# Altium project ESP32_Projet.PrjPcb
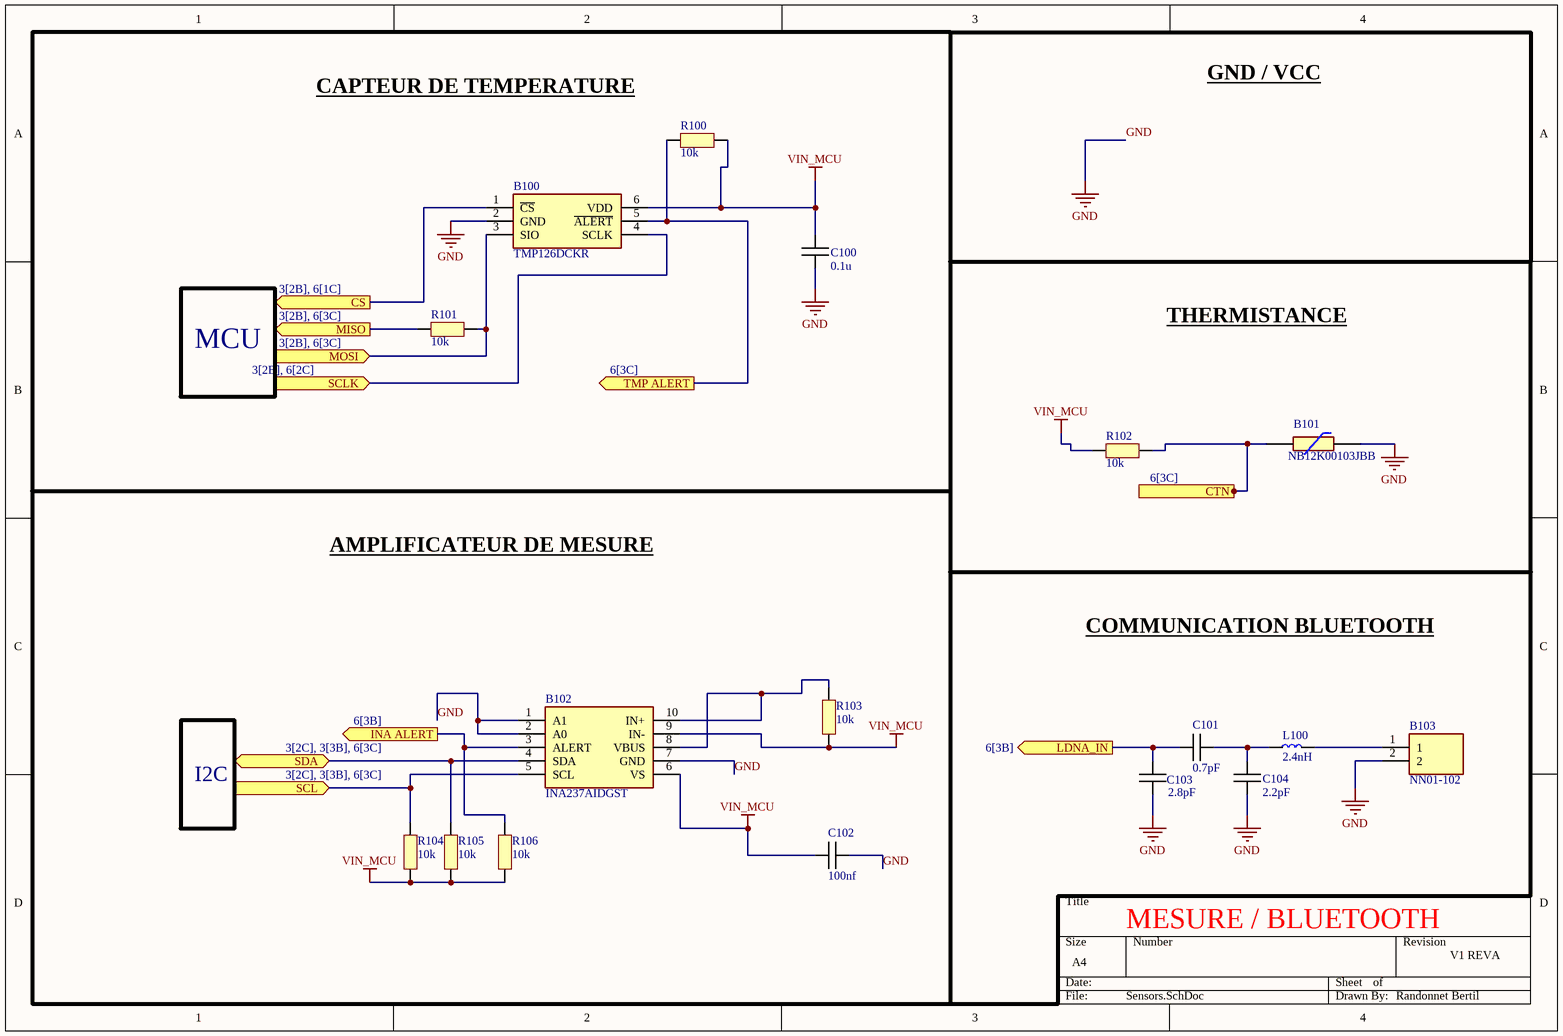
[diagram p0: Sensors.SchDoc]
6 sheets, 73 parts. Net scope: flat (ports and power ports of the same name join across sheets).
Board files: PCB1.PcbDoc, Copy of PCB1.PcbDoc
Sheets:
  Sensors.SchDoc
  protocoles de comm.SchDoc
  connecteurs.SchDoc
  IHM.SchDoc
  alim.SchDoc
  MCU_ESP32.SchDoc

## Sheet Sensors.SchDoc
size A4; SheetNumber: 1; SheetTotal: 6

### Parts
B100  TMP126DCKR  [SOT65P210X110-6N]
B101  NB12K00103JBB  [RESC2212X50N]
B102  INA237AIDGST  [SOP50P490X110-10N]
B103  NN01-102  [NN01-102]
C100  0.1u  [CAPC1005X06N]
C101  0.7pF  [CAPC1005X06N]
C102  100nf  [CAPC1005X06N]
C103  2.8pF  [CAPC1005X06N]
C104  2.2pF  [CAPC1005X06N]
L100  2.4nH  [LQPC1005X06N]
R100  10k  [RESC1005X06N]
R101  10k  [RESC1005X06N]
R102  10k  [RESC1005X06N]
R103  10k  [RESC1005X06N]
R104  10k  [RESC1005X06N]
R105  10k  [RESC1005X06N]
R106  10k  [RESC1005X06N]

### Ports
CS (out, see 3[2B], 6[1C]), CTN (out, see 6[3C]), INA ALERT (out, see 6[3B]), LDNA_IN (out, see 6[3B]), MISO (out, see 3[2B], 6[3C]), MOSI (in, see 3[2B], 6[3C]), SCL (in, see 3[2C], 3[3B], 6[3C]), SCLK (in, see 3[2B], 6[2C]), SDA (bidir, see 3[2C], 3[3B], 6[3C]), TMP ALERT (out, see 6[3C])

### Nets
GND: B100.2(GND) B101.1 B102.1(A1) B102.2(A0) B102.7(GND) B103.2 C100.2 C102.1 C103.2 C104.2
VIN_MCU: B100.6(VDD) B102.6(VS) B102.9(IN-) C100.1 C102.2 R100.2 R102.1 R103.1 R104.1 R105.1 R106.1
NetB100_1: B100.1(~{CS}) ; port CS
NetB100_3: B100.3(SIO) R101.2 ; port MOSI
NetB100_4: B100.4(SCLK) ; port SCLK
NetB100_5: B100.5(~{ALERT}) R100.1 ; port TMP ALERT
NetB101_2: B101.2 R102.2 ; port CTN
NetB102_3: B102.3(ALERT) R106.2 ; port INA ALERT
NetB102_4: B102.4(SDA) R105.2 ; port SDA
NetB102_5: B102.5(SCL) R104.2 ; port SCL
NetB102_8: B102.8(VBUS) B102.10(IN+) R103.2
NetB103_1: B103.1 L100.2
NetC101_1: C101.1 C103.1 ; port LDNA_IN
NetC101_2: C101.2 C104.1 L100.1
NetJ300_5: R101.1 ; port MISO

### Notes on the sheet
- CAPTEUR DE TEMPERATURE <https://www.ti.com/lit/ds/symlink/tmp126.pdf?ts=1732713559769&ref_url=https%253A%252F%252Fwww.ti.com%252Fproduct%252FTMP126>
- GND / VCC
- MCU
- THERMISTANCE <https://www.mouser.fr/datasheet/2/40/nc12_20-3165165.pdf>
- AMPLIFICATEUR DE MESURE <https://www.ti.com/lit/ds/symlink/ina237.pdf?ts=1732718382153&ref_url=https%253A%252F%252Fwww.ti.com%252Famplifier-circuit%252Fcurrent-sense%252Fdigital-power-monitors%252Fproducts.html>
- COMMUNICATION BLUETOOTH <https://www.mouser.fr/datasheet/2/40/nc12_20-3165165.pdf>
- I2C
- MESURE / BLUETOOTH
- V1 REVA
- Randonnet Bertil

### Library data of the parts
B100 = TMP126DCKR: Board Mount Temperature Sensors +/-0.25 C SPI temperature sensor with 175 C operation, CRC and slew-rate alert; Manufacturer_Name: Texas Instruments; Manufacturer_Part_Number: TMP126DCKR; Mouser Part Number: 595-TMP126DCKR
B101 = NB12K00103JBB: NTC SMD Thermistor, NB12K, 10K, 5% AVX 10k 0805 Protection NTC Thermistor, 5s, 2 x 1.25 x 1.3mm; Manufacturer_Name: Kyocera AVX; Geometry.Height: 0.5mm; Manufacturer_Part_Number: NB12K00103JBB; Mouser Part Number: 581-NB12K00103JBB; Mouser Price/Stock: https://www.mouser.co.uk/ProductDetail/AVX/NB12K00103JBB/?qs=4%252B6%252BTdINQeDPvI%252BQUQjJ3Q%3D%3D; Arrow Part Number: NB12K00103JBB; Arrow Price/Stock: https://www.arrow.com/en/products/nb12k00103jbb/avx; Datasheet Link: https://datasheet.datasheetarchive.com/originals/distributors/Datasheets-DGA6/551314.pdf
B102 = INA237AIDGST: Current Sense Amplifiers 85-V, 16-bit, I2C output current/voltage/power monitor with alert 10-VSSOP -40 to 125; Manufacturer_Name: Texas Instruments; Manufacturer_Part_Number: INA237AIDGST; Mouser Part Number: 595-INA237AIDGST
B103 = NN01-102: Antennes Compact Reach Xtend 2.4 GHz
C100-C104 = Capacitor
L100 = Bobine
R100-R106 = Resistor

## Sheet protocoles de comm.SchDoc: Protocole de communication
size A4; DrawnBy: TAHIRI Manelle; Revision: V1.0 REVA; SheetNumber: 2; SheetTotal: 5
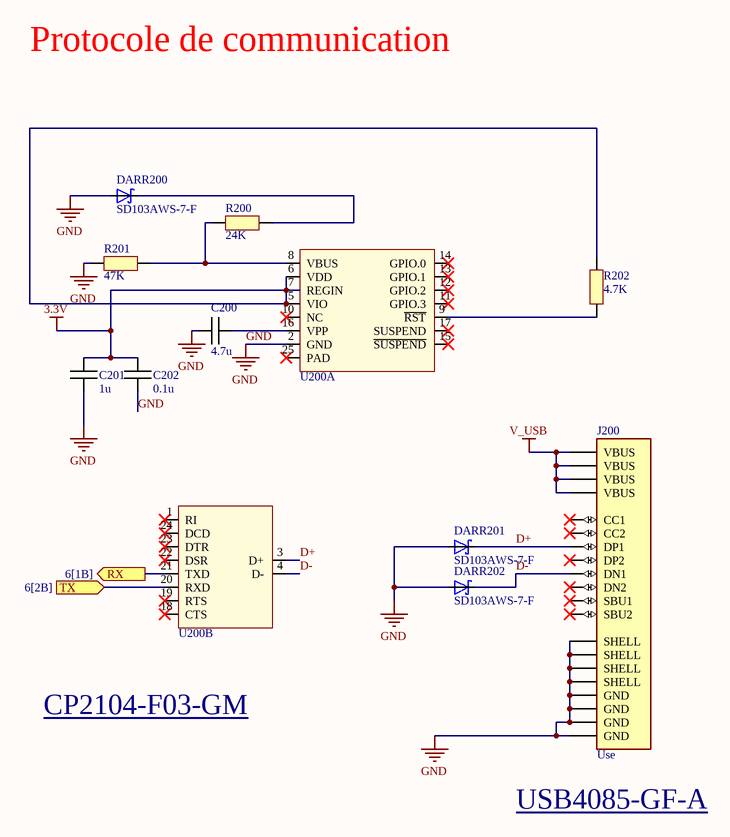
[diagram p1: protocoles de comm.SchDoc]

### Parts
C200  4.7u  [CAPC1005X06N]
C201  1u  [CAPC1005X06N]
C202  0.1u  [CAPC1005X06N]
DARR200  SD103AWS-7-F  [SD103AWS-7-F]
DARR201  SD103AWS-7-F  [SD103AWS-7-F]
DARR202  SD103AWS-7-F  [SD103AWS-7-F]
J200  Use  [USB4085-GF-A]
R200  24K  [RESC1005X06N]
R201  47K  [RESC1005X06N]
R202  4.7K  [RESC1005X06N]
U200  CP2104-F03-GM  [PQFN50P400X400X80_HS-25N]  (value not drawn)  (parts A,B of 2)

### Ports
RX (out, see 6[1B]), TX (in, see 6[2B])

### Nets
3.3V: C201.2 C202.2 R202.2 U200.5(VIO) U200.6(VDD) U200.7(REGIN)
GND: C200.1 C201.1 C202.1 DARR200.2(A) DARR201.2(A) DARR202.2(A) J200.A1(GND) J200.A12(GND) J200.B1(GND) J200.B12(GND) J200.S1(SHELL) J200.S2(SHELL) J200.S3(SHELL) J200.S4(SHELL) R201.1 U200.2(GND)
V_USB: J200.A4(VBUS) J200.A9(VBUS) J200.B4(VBUS) J200.B9(VBUS)
D+: DARR201.1(C) J200.A6(DP1) U200.3(D+)
D-: DARR202.1(C) J200.A7(DN1) U200.4(D-)
NetC200_2: C200.2 U200.16(VPP)
NetDARR200_1: DARR200.1(C) R200.2
NetR200_1: R200.1 R201.2 U200.8(VBUS)
NetR202_1: R202.1 U200.9(~{RST})
NetU100_40: U200.20(RXD) ; port TX
NetU100_41: U200.21(TXD) ; port RX

Not connected (* = marked no-connect by the designer): J200 A5(CC1)* A8(SBU1)* B5(CC2)* B6(DP2)* B7(DN2)* B8(SBU2)*; U200 1(RI)* 10(NC)* 11(GPIO.3)* 12(GPIO.2)* 13(GPIO.1)* 14(GPIO.0)* 15(~{SUSPEND})* 17(SUSPEND)* 18(CTS)* 19(RTS)* 22(DSR)* 23(DTR)* 24(DCD)* 25(PAD)*

### Notes on the sheet
- Protocole de communication
- CP2104-F03-GM <https://www.mouser.fr/datasheet/2/368/cp2104-1397921.pdf>
- (near J200) USB4085-GF-A <https://www.mouser.fr/datasheet/2/837/GCT_usb4085-3240028.pdf>

### Library data of the parts
C200-C202 = Capacitor
DARR200-DARR202 = SD103AWS-7-F: Diode Array 3 Independent Schottky 40V 175mA Surface Mount 6-TSSOP, SC-88, SOT-363
J200 = USB4085-GF-A: Connecteurs USB USB Type C, 2.0, Rec, TH , G/F, RA , Top Mnt, T & R
R200-R202 = Resistor
U200 = USBBridge: USB Bridge, USB to UART USB 2.0 UART Interface 24-QFN (4x4); Manufacturer 1: Silicon Labs; Supplier 1: Arrow Electronics; Supplier Part Number 1: CP2104-F03-GM; Manufacturer Part Number 1: CP2104-F03-GM

## Sheet connecteurs.SchDoc: Connecteurs
size A4; DrawnBy: TAHIRI Manelle; Revision: V1.0 REVA; SheetNumber: 3; SheetTotal: 6
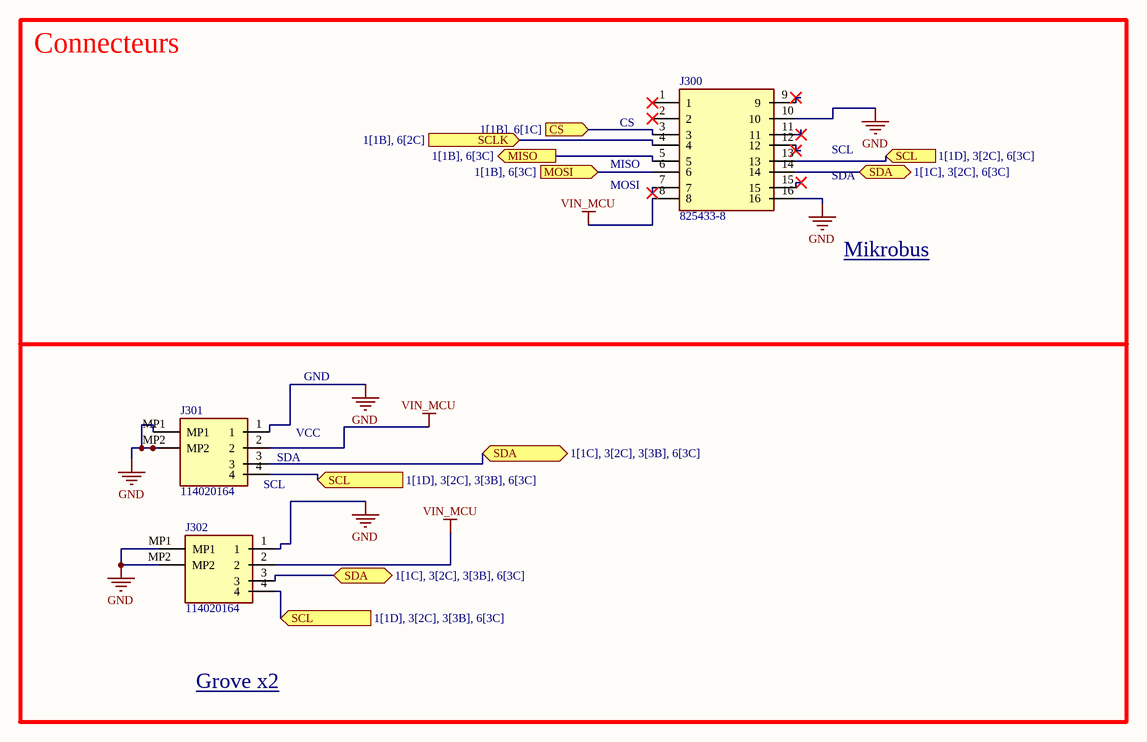
[diagram p2: connecteurs.SchDoc]

### Parts
J300  825433-8
J301  114020164  [114020164]
J302  114020164  [114020164]

### Blocks framed on the sheet
Connecteurs: J300-J302

### Ports
CS (in, see 1[1B], 6[1C]), MISO (out, see 1[1B], 6[3C]), MOSI (in, see 1[1B], 6[3C]), SCL (in, see 1[1D], 3[2C], 3[3B], 6[3C]), SCL (in, see 1[1D], 3[2C], 6[3C]), SCLK (in, see 1[1B], 6[2C]), SDA (bidir, see 1[1C], 3[2C], 3[3B], 6[3C]), SDA (bidir, see 1[1C], 3[2C], 6[3C])

### Nets
GND: J300.10 J300.16 J301.1 J301.MP1 J301.MP2 J302.1 J302.MP1 J302.MP2
VIN_MCU: J300.8 J301.2 J302.2
NetB100_1: J300.3 ; port CS
NetB100_3: J300.6 ; port MOSI
NetB100_4: J300.4 ; port SCLK
NetB102_4: J300.14 J301.3 J302.3 ; port SDA
NetB102_5: J300.13 J301.4 J302.4 ; port SCL
NetJ300_5: J300.5 ; port MISO

Not connected (* = marked no-connect by the designer): J300 1* 2* 7* 9* 11* 12* 15*

### Notes on the sheet
- (near J300) MISO
- (near J300) CS
- SCL
- (near J300) MOSI
- SDA
- Mikrobus <https://www.mouser.fr/datasheet/2/418/7/ENG_CD_825433_S_baseFilename-2068619.pdf>
- (near J301) VCC
- GND
- (near J301) SCL
- (near J301) SDA
- Grove x2 <https://www.mouser.fr/datasheet/2/744/Grove_Female_Header___SMD_4P_2_0mm_90D_Datasheet-3011316.pdf>

### Library data of the parts
J300 = Connect-Mikronus: Headers & Wire Housings 8P double for connection mikrobus; Manufacturer_Name: TE Connectivity; Manufacturer_Part_Number: 825433-8; Mouser Part Number: 571-825433-8
J301 J302 = 114020164: Seeed Studio Accessories Grove Female Header - SMD-4P-2.0mm-90D-20Pcs; Manufacturer_Name: Seeed Studio; Manufacturer_Part_Number: 114020164; Mouser Part Number: 713-114020164

## Sheet IHM.SchDoc: IHM
size A4; DrawnBy: Assil MAHFOUDI; Revision: V1.0 REV A; SheetNumber: 4; SheetTotal: 6
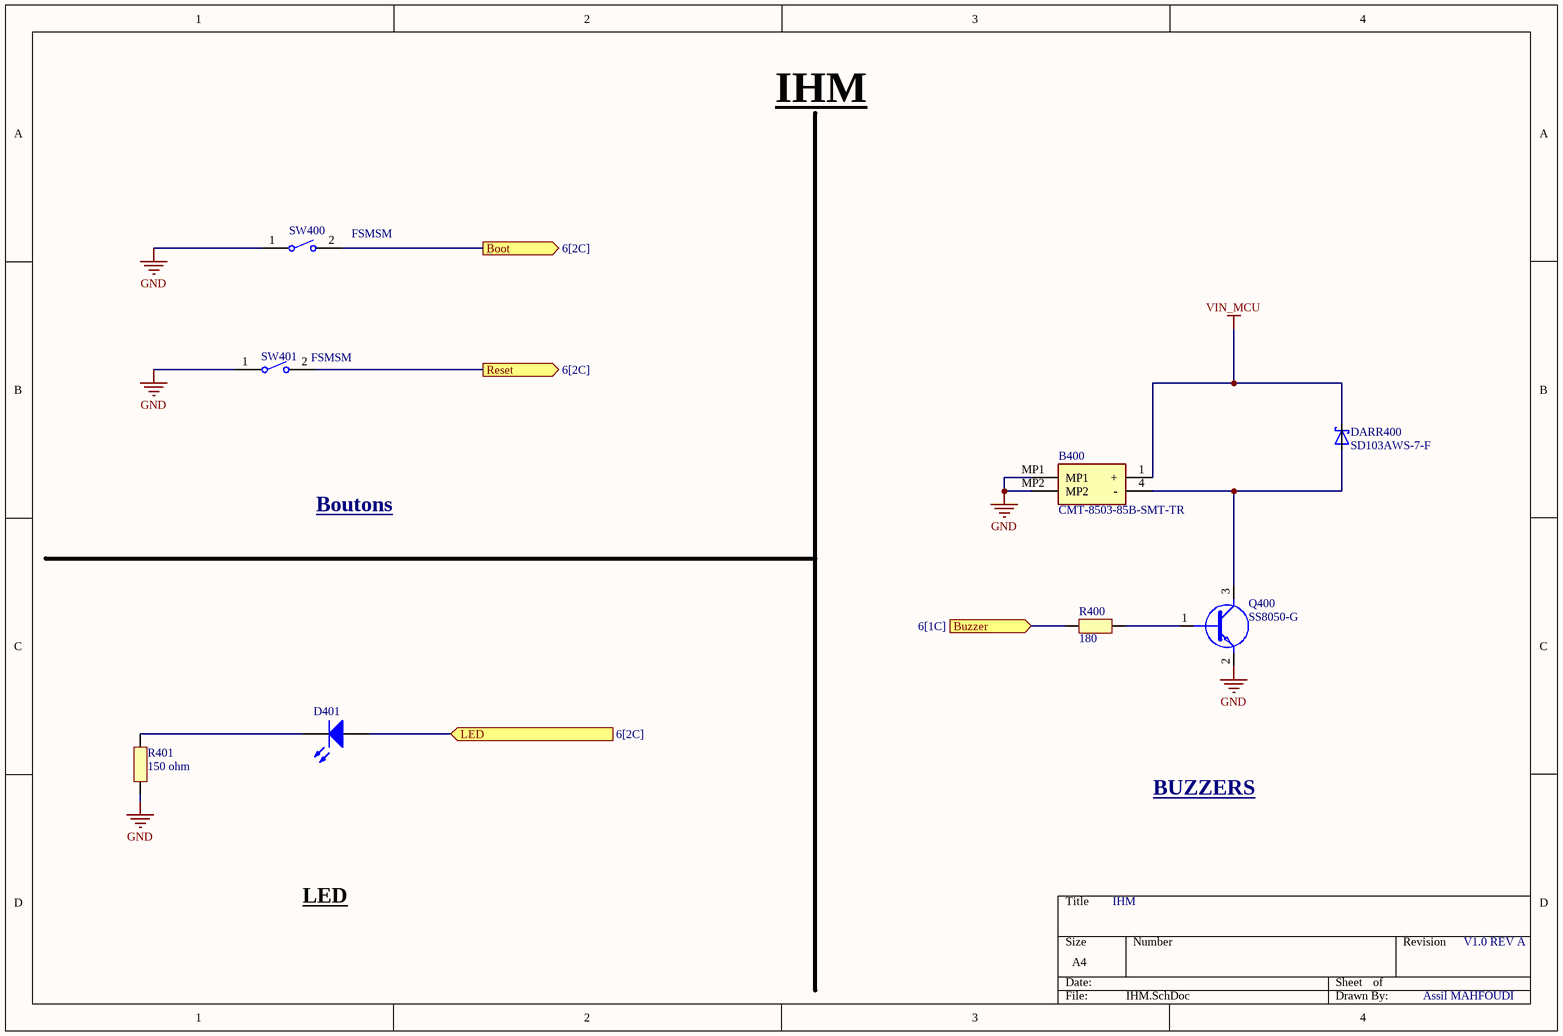
[diagram p3: IHM.SchDoc]

### Parts
B400  CMT-8503-85B-SMT-TR  [CMT850385BSMTTR]
D401  Light-Emitting Diode  (value not drawn)
DARR400  SD103AWS-7-F  [SD103AWS-7-F]
Q400  SS8050-G  [SS8050-G]
R400  180  [RESC1005X06N]
R401  150 ohm  [RESC1005X06N]
SW400  FSMSM  [TECO-FSMSM-2_V]
SW401  FSMSM  [TECO-FSMSM-2_V]

### Ports
Boot (out, see 6[2C]), Buzzer (in, see 6[1C]), LED (in, see 6[2C]), Reset (out, see 6[2C])

### Nets
GND: B400.MP1 B400.MP2 Q400.2(E) R401.1 SW400.1 SW401.1
VIN_MCU: B400.1(+) DARR400.1(C)
NetB400_4: B400.4(-) DARR400.2(A) Q400.3(C)
NetD401_1: D401.1(A) ; port LED
NetD401_2: D401.2(K) R401.2
NetQ400_1: Q400.1(B) R400.2
NetR400_1: R400.1 ; port Buzzer
NetSW400_2: SW400.2 ; port Boot
NetSW401_2: SW401.2 ; port Reset

### Notes on the sheet
- IHM
- Boutons <https://docs.rs-online.com/d386/0900766b80fa5b10.pdf>
- BUZZERS <https://eu.mouser.com/datasheet/2/1628/cmt_8503_85b_smt_tr-3509034.pdf>
- LED

### Library data of the parts
B400 = CMT-8503-85B-SMT-TR: Speakers & Transducers buzzer, 8.5 mm, 3 mm deep, M, 3.6 V, 85 dB, Surface Mount (SMT), Audio Transducer; Manufacturer_Name: Same Sky; Manufacturer_Part_Number: CMT-8503-85B-SMT-TR; Mouser Part Number: 490-CMT-850385BSMTTR
D401 = LED: AF: 1; BV: 0; BV_MAX: 1e99; EG: 1.11; FC: 0.5; IBV: 0.001; IS: 1e-14; MJSW: 0.33; NTUN: 30; TNOM: 27; XTI: 3; SimulationGenericComponent: True; CJO: 0; CJP: 0; CTA: 0; CTP: 0; FCS: 0.5; FV_MAX: 1e99; IKF: 0; IKR: 0; ISR: 1e-14; JSW: 0; JTUN: 0; JTUNSW: 0; KEG: 1; KF: 0; LEVEL: 1; N: 1; NBV: 1; NR: 1; NS: 1; PHP: 1; RS: 0; TCV: 0; TLEV: 0; TLEVC: 0; TM1: 0; TM2: 0; TPB: 0; TPHP: 0; TRS: 0; TRS2: 0; TT: 0; TTT1: 0; TTT2: 0; VJ: 1; XTITUN: 3
DARR400 = SD103AWS-7-F: as DARR200 on sheet protocoles de comm
Q400 = SS8050-G: Bipolar Transistors - BJT NPN TRANSISTOR 1.5A 40V
R400 R401 = Resistor
SW400 SW401 = CMP-2000-07511-1: FSMSM Push Button Switch, 50 mA, -35 to 85 degC, 2-Pin SMD, RoHS, Bulk; Manufacturer: TE Connectivity; Actuator Length: 1.07mm; Electrical Life: 20000Cycles; Actuator Material: Polyamide; Current Rating: 50mA; Illumination Type: Illuminated; Voltage Rating (DC): 24V; Contact Resistance: 100mOhm; Case\/Package: SMD/SMT; Operating Force: 180gf; Switch Travel: 0.25mm; Max Voltage Rating (DC): 12V; Throw Configuration: SPST; Packaging: LoosePiece; Max Operating Temperature: 85degC; ELV: Compliant; Package Description: 2-Pin Surface Mount Device, Body 6 x 3.5 mm, Pitch 9.19 mm; RoHSCompliant: true; Manufacturer URL: http://www.te.com/; Contact Plating: Silver; Contact Material: Brass; Mounting Technology: SurfaceMount; Contact Current Rating: 50mA; Datasheet Version: Rev. C2, 08/2014; Datasheet URL: http://www.te.com/commerce/DocumentDelivery/DDEController?Action=showdoc&DocId=Customer+Drawing%7F1437566-3%7FC2%7Fpdf%7FEnglish%7FENG_CD_1437566-3_C2_1437566_3_1_c.dwg.pdf%7F1437566-3; Mechanical Life: 20000Cycles; Package Reference: FSMSM; REACH SVHC: Unknown; Orientation: Straight; Min Operating Temperature: -35degC; Lead Free: LeadFree; Termination: GullWing; Package Quantity: 1000; Mount: SurfaceMount

## Sheet alim.SchDoc: Alimentation
size A4; ApprovedBy: Bertil RANDONNET; CheckedBy: Manelle TAHIRI; Author: Assil MAHFOUDI; DrawnBy: Assil MAHFOUDI; Engineer: Assil MAHFOUDI; Revision: V1.0 REV A; SheetNumber: 5; SheetTotal: 5
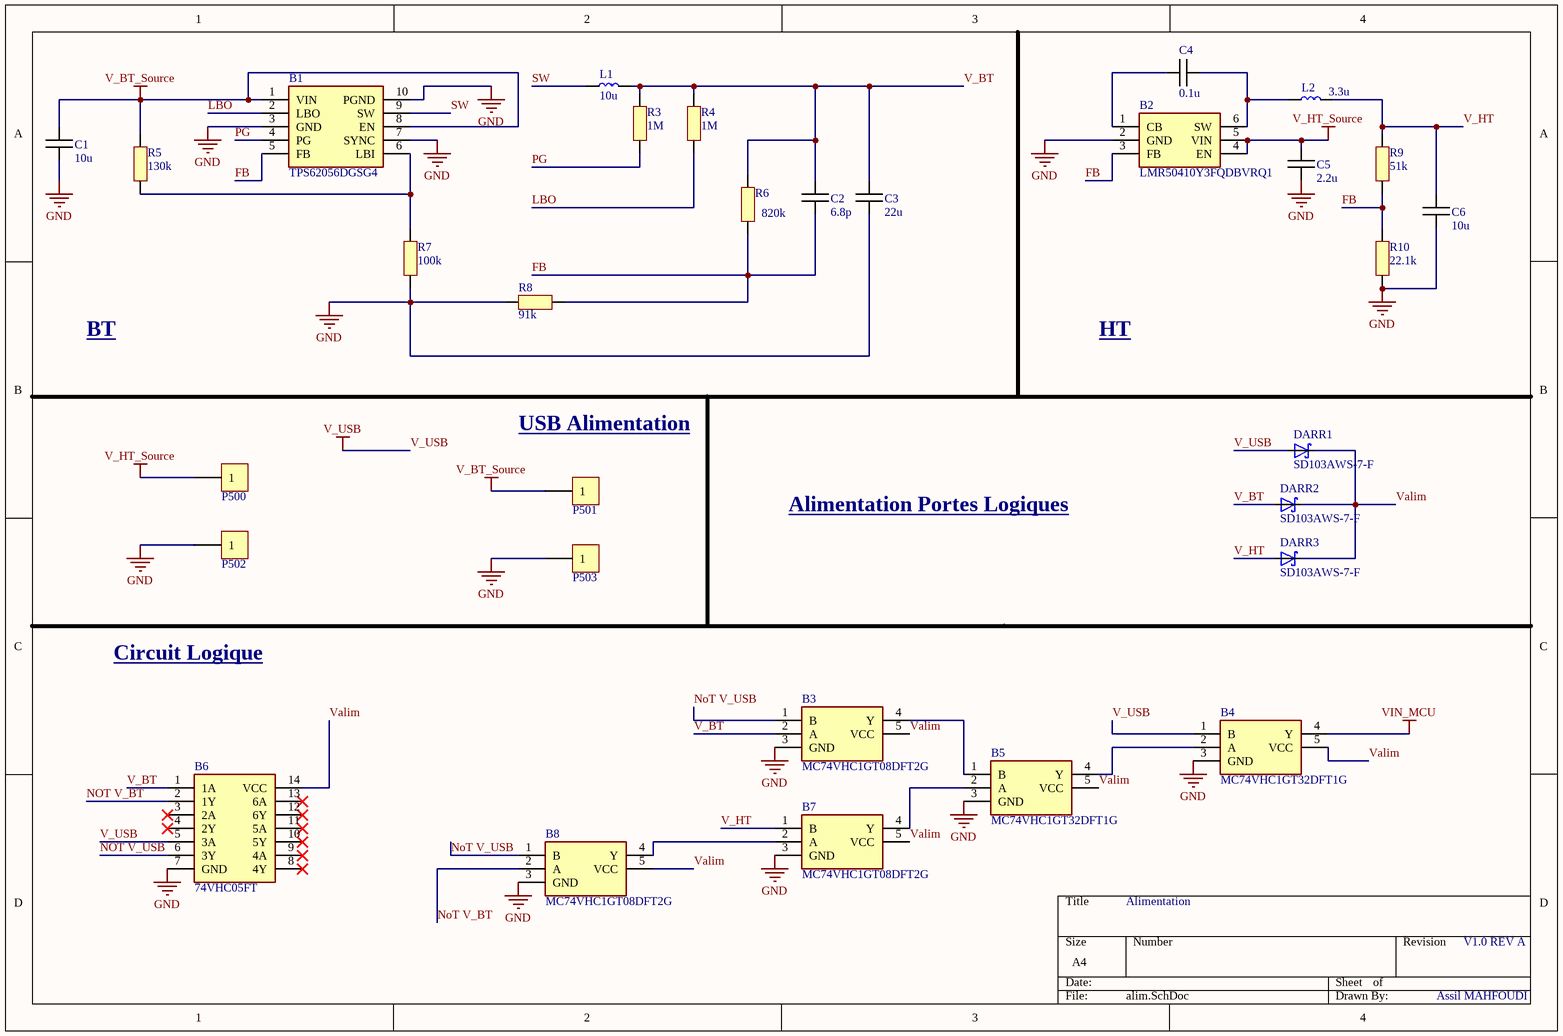
[diagram p4: alim.SchDoc]

### Parts
B1  TPS62056DGSG4  [SOP50P490X110-10N]
B2  LMR50410Y3FQDBVRQ1  [SOT95P280X145-6N]
B3  MC74VHC1GT08DFT2G  [SOT65P210X110-5N]
B4  MC74VHC1GT32DFT1G  [SOT65P210X110-5N]
B5  MC74VHC1GT32DFT1G  [SOT65P210X110-5N]
B6  74VHC05FT  [SOP65P640X120-14N]
B7  MC74VHC1GT08DFT2G  [SOT65P210X110-5N]
B8  MC74VHC1GT08DFT2G  [SOT65P210X110-5N]
C1  10u  [CAPC1005X06N]
C2  6.8p  [CAPC1005X06N]
C3  22u  [CAPC1005X06N]
C4  0.1u  [CAPC1005X06N]
C5  2.2u  [CAPC1005X06N]
C6  10u  [CAPC1005X06N]
DARR1  SD103AWS-7-F  [SD103AWS-7-F]
DARR2  SD103AWS-7-F  [SD103AWS-7-F]
DARR3  SD103AWS-7-F  [SD103AWS-7-F]
L1  10u  [LQPC1005X06N]
L2  3.3u  [LQPC1005X06N]
P500  Plage CMS 10x5  [Plage CMS 10x5]  (value not drawn)  (no BOM)
P501  Plage CMS 10x5  [Plage CMS 10x5]  (value not drawn)  (no BOM)
P502  Plage CMS 10x5  [Plage CMS 10x5]  (value not drawn)  (no BOM)
P503  Plage CMS 10x5  [Plage CMS 10x5]  (value not drawn)  (no BOM)
R3  1M  [RESC1005X06N]
R4  1M  [RESC1005X06N]
R5  130k  [RESC1005X06N]
R6  820k  [RESC1005X06N]
R7  100k  [RESC1005X06N]
R8  91k  [RESC1005X06N]
R9  51k  [RESC1005X06N]
R10  22.1k  [RESC1005X06N]

### Nets
GND: B1.3(GND) B1.7(SYNC) B1.10(PGND) B2.2(GND) B3.3(GND) B4.3(GND) B5.3(GND) B6.7(GND) B7.3(GND) B8.3(GND) C1.1 C3.2 C5.2 C6.1 P502.1 P503.1 R7.1 R8.1 R10.1
V_BT_Source: B1.1(VIN) B1.8(EN) C1.2 P501.1 R5.2
V_HT_Source: B2.4(EN) B2.5(VIN) C5.1 P500.1
V_USB: B4.1(B) B6.5(3A) DARR1.2(A)
VIN_MCU: B4.4(Y)
FB: B1.5(FB) B2.3(FB) C2.1 R6.1 R8.2 R9.1 R10.2
LBO: B1.2(LBO) R4.1
NOT V_BT: B6.2(1Y) B8.2(A)
NOT V_USB: B3.1(B) B6.6(3Y) B8.1(B)
PG: B1.4(PG) R3.1
SW: B1.9(SW) L1.1
V_BT: B3.2(A) B6.1(1A) C2.2 C3.1 DARR2.2(A) L1.2 R3.2 R4.2 R6.2
V_HT: B7.1(B) C6.2 DARR3.2(A) L2.2 R9.2
Valim: B3.5(VCC) B4.5(VCC) B5.5(VCC) B6.14(VCC) B7.5(VCC) B8.5(VCC) DARR1.1(C) DARR2.1(C) DARR3.1(C)
NetB1_6: B1.6(LBI) R5.1 R7.2
NetB2_1: B2.1(CB) C4.2
NetB2_6: B2.6(SW) C4.1 L2.1
NetB3_4: B3.4(Y) B5.1(B)
NetB4_2: B4.2(A) B5.4(Y)
NetB5_2: B5.2(A) B7.4(Y)
NetB7_2: B7.2(A) B8.4(Y)

Not connected (* = marked no-connect by the designer): B6 3(2A)* 4(2Y)* 8(4Y)* 9(4A)* 10(5Y)* 11(5A)* 12(6Y)* 13(6A)*

### Notes on the sheet
- BT
- HT
- USB Alimentation
- Alimentation Portes Logiques
- Circuit Logique

### Library data of the parts
B1 = TPS62056DGSG4: TEXAS INSTRUMENTS - TPS62056DGSG4 - Synchronous Buck (Step Down) Switching Regulator, Fixed, 2.7V-10Vin, 3.3V/0.8A out, 850kHz, VSSOP-10; Manufacturer_Name: Texas Instruments; Manufacturer_Part_Number: TPS62056DGSG4; Mouser Part Number: 595-TPS62056DGSG4
B2 = LMR50410Y3FQDBVRQ1: Régulateurs de tension de commutation Automotive qualified SIMPLE SWITCHER 4-V to 36-V, 1-A synchronous step-down converter 6-SOT-23 -40 to 150; Manufacturer_Name: Texas Instruments; Manufacturer_Part_Number: LMR50410Y3FQDBVRQ1; Mouser Part Number: 595-R50410Y3FQDBVRQ1
B3 B7 B8 = MC74VHC1GT08DFT2G: Single 2-Input AND Gate, TTL Level; Manufacturer_Name: onsemi; Manufacturer_Part_Number: MC74VHC1GT08DFT2G; Parameter 3: *
B4 B5 = MC74VHC1GT32DFT1G: Single 2-Input OR Gate, TTL Level; Manufacturer_Name: onsemi; Manufacturer_Part_Number: MC74VHC1GT32DFT1G; Mouser Part Number: 863-C74VHC1GT32DFT1G
B6 = 74VHC05FT: Logic Gates CMOS LOGIC IC INVERTER; Manufacturer_Name: Toshiba; Manufacturer_Part_Number: 74VHC05FT; Mouser Part Number: 757-74VHC05FT
C1-C6 = Capacitor
DARR1-DARR3 = SD103AWS-7-F: as DARR200 on sheet protocoles de comm
L1 L2 = Bobine
P500-P503 = Plage CMS 10x5: Plage de report CMS 10x5mm; PN: L30; Value: Plage CMS 10x5; Footprint_statut: ok
R3-R10 = Resistor

## Sheet MCU_ESP32.SchDoc: Projet M1 2024
size A4; DrawnBy: Group 04; DocumentNumber: 1; Revision: V1.0 Rev A; SheetNumber: 6; SheetTotal: 6
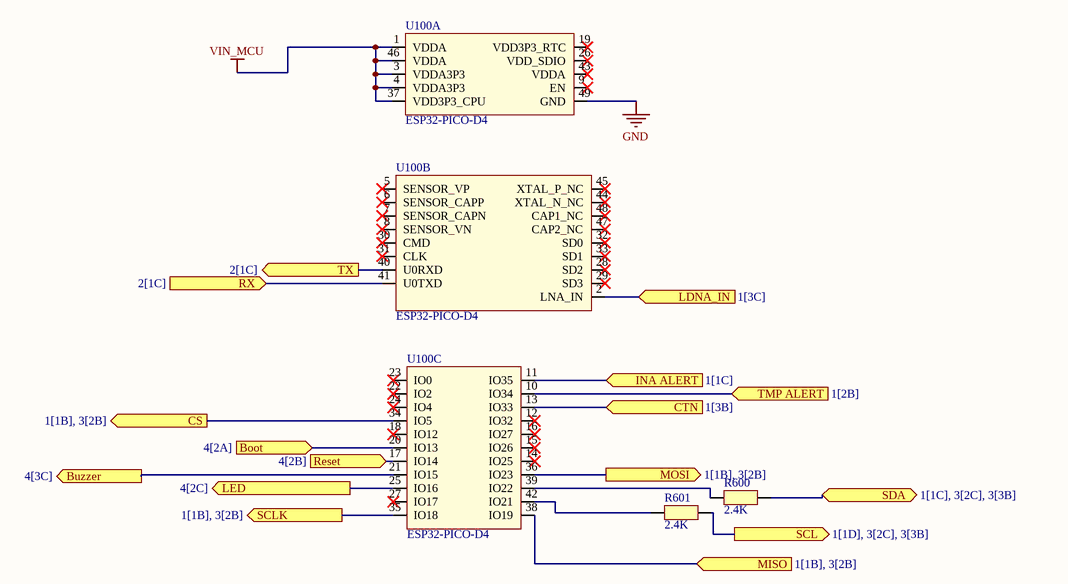
[diagram p5: MCU_ESP32.SchDoc]

### Parts
R600  2.4K  [RESC1005X06N]
R601  2.4K  [RESC1005X06N]
U100  ESP32-PICO-D4  [PQFN50P700X700X104_HS-49N]  (parts A,B,C of 3)

### Ports
Boot (in, see 4[2A]), Buzzer (out, see 4[3C]), CS (out, see 1[1B], 3[2B]), CTN (in, see 1[3B]), INA ALERT (in, see 1[1C]), LDNA_IN (in, see 1[3C]), LED (out, see 4[2C]), MISO (in, see 1[1B], 3[2B]), MOSI (out, see 1[1B], 3[2B]), Reset (in, see 4[2B]), RX (in, see 2[1C]), SCL (out, see 1[1D], 3[2C], 3[3B]), SCLK (out, see 1[1B], 3[2B]), SDA (bidir, see 1[1C], 3[2C], 3[3B]), TMP ALERT (in, see 1[2B]), TX (out, see 2[1C])

### Nets
GND: U100.49(GND)
VIN_MCU: U100.1(VDDA) U100.3(VDDA3P3) U100.4(VDDA3P3) U100.37(VDD3P3_CPU) U100.46(VDDA)
NetB100_1: U100.34(IO5) ; port CS
NetB100_3: U100.36(IO23) ; port MOSI
NetB100_4: U100.35(IO18) ; port SCLK
NetB100_5: U100.10(IO34) ; port TMP ALERT
NetB101_2: U100.13(IO33) ; port CTN
NetB102_3: U100.11(IO35) ; port INA ALERT
NetB102_4: R600.2 ; port SDA
NetB102_5: R601.2 ; port SCL
NetC101_1: U100.2(LNA_IN) ; port LDNA_IN
NetD401_1: U100.25(IO16) ; port LED
NetJ300_5: U100.38(IO19) ; port MISO
NetR400_1: U100.21(IO15) ; port Buzzer
NetR600_1: R600.1 U100.39(IO22)
NetR601_1: R601.1 U100.42(IO21)
NetSW400_2: U100.20(IO13) ; port Boot
NetSW401_2: U100.17(IO14) ; port Reset
NetU100_40: U100.40(U0RXD) ; port TX
NetU100_41: U100.41(U0TXD) ; port RX

Not connected (* = marked no-connect by the designer): U100 5(SENSOR_VP)* 6(SENSOR_CAPP)* 7(SENSOR_CAPN)* 8(SENSOR_VN)* 9(EN)* 12(IO32)* 14(IO25)* 15(IO26)* 16(IO27)* 18(IO12)* 19(VDD3P3_RTC)* 22(IO2)* 23(IO0)* 24(IO4)* 26(VDD_SDIO)* 27(IO17)* 28(SD2)* 29(SD3)* 30(CMD)* 31(CLK)* 32(SD0)* 33(SD1)* 43(VDDA)* 44(XTAL_N_NC)* 45(XTAL_P_NC)* 47(CAP2_NC)* 48(CAP1_NC)*

### Library data of the parts
R600 R601 = Resistor
U100 = ESP32: Système RF sur puce - SoC SIP module ESP32 with 4MByte Flash, Dual Core MCU, Wi-Fi & Bluetooth Combo, LGA48-pin, 7*7mm; Manufacturer 1: Espressif Systems; Supplier 1: Digi-Key; Supplier Part Number 1: 1904-1029-1-ND; Manufacturer Part Number 1: ESP32-PICO-D4

## Nets that join several sheets
GND: Sensors (10 pins), protocoles de comm (16 pins), connecteurs (8 pins), IHM (6 pins), alim (19 pins), MCU_ESP32 (U100.49)
V_USB: protocoles de comm (J200.A4 J200.A9 J200.B4 J200.B9), alim (B4.1 B6.5 DARR1.2)
VIN_MCU: Sensors (11 pins), connecteurs (J300.8 J301.2 J302.2), IHM (B400.1 DARR400.1), alim (B4.4), MCU_ESP32 (5 pins)
NetB100_1: Sensors (B100.1), connecteurs (J300.3), MCU_ESP32 (U100.34)
NetB100_3: Sensors (B100.3 R101.2), connecteurs (J300.6), MCU_ESP32 (U100.36)
NetB100_4: Sensors (B100.4), connecteurs (J300.4), MCU_ESP32 (U100.35)
NetB100_5: Sensors (B100.5 R100.1), MCU_ESP32 (U100.10)
NetB101_2: Sensors (B101.2 R102.2), MCU_ESP32 (U100.13)
NetB102_3: Sensors (B102.3 R106.2), MCU_ESP32 (U100.11)
NetB102_4: Sensors (B102.4 R105.2), connecteurs (J300.14 J301.3 J302.3), MCU_ESP32 (R600.2)
NetB102_5: Sensors (B102.5 R104.2), connecteurs (J300.13 J301.4 J302.4), MCU_ESP32 (R601.2)
NetC101_1: Sensors (C101.1 C103.1), MCU_ESP32 (U100.2)
NetD401_1: IHM (D401.1), MCU_ESP32 (U100.25)
NetJ300_5: Sensors (R101.1), connecteurs (J300.5), MCU_ESP32 (U100.38)
NetR400_1: IHM (R400.1), MCU_ESP32 (U100.21)
NetSW400_2: IHM (SW400.2), MCU_ESP32 (U100.20)
NetSW401_2: IHM (SW401.2), MCU_ESP32 (U100.17)
NetU100_40: protocoles de comm (U200.20), MCU_ESP32 (U100.40)
NetU100_41: protocoles de comm (U200.21), MCU_ESP32 (U100.41)